# Altium schematic sheet 2_Buffer.SCHDOC
size 297 x 209 mm; SheetNumber: 6; SheetTotal: 18; DocumentName: 2_Buffer.SCHDOC
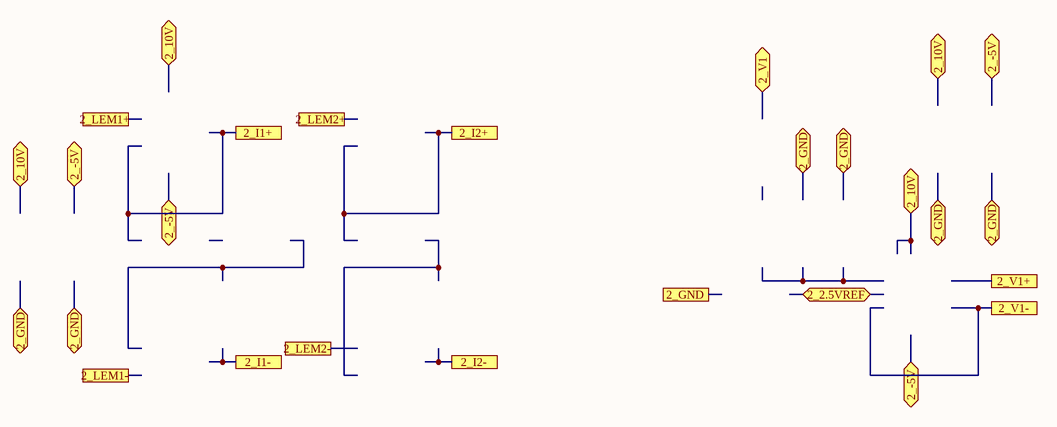
[diagram p0: 2_Buffer.SCHDOC]

## Ports
2_2.5VREF (bidir), 2_10V, 2_-5V, 2_GND, 2_I1+, 2_I1-, 2_I2+, 2_I2-, 2_LEM1+, 2_LEM1-, 2_LEM2+, 2_LEM2-, 2_V1, 2_V1+, 2_V1-

## Notes on the sheet
- A
- B
- C
- D
- 1
- 2
- 3
- Title
- 4
- Size
- A4
- Number
- Rev
- Date
- Filename
- Drawn by
- Sheet
- of